# Altium schematic sheet Interface1.SchDoc
size A4
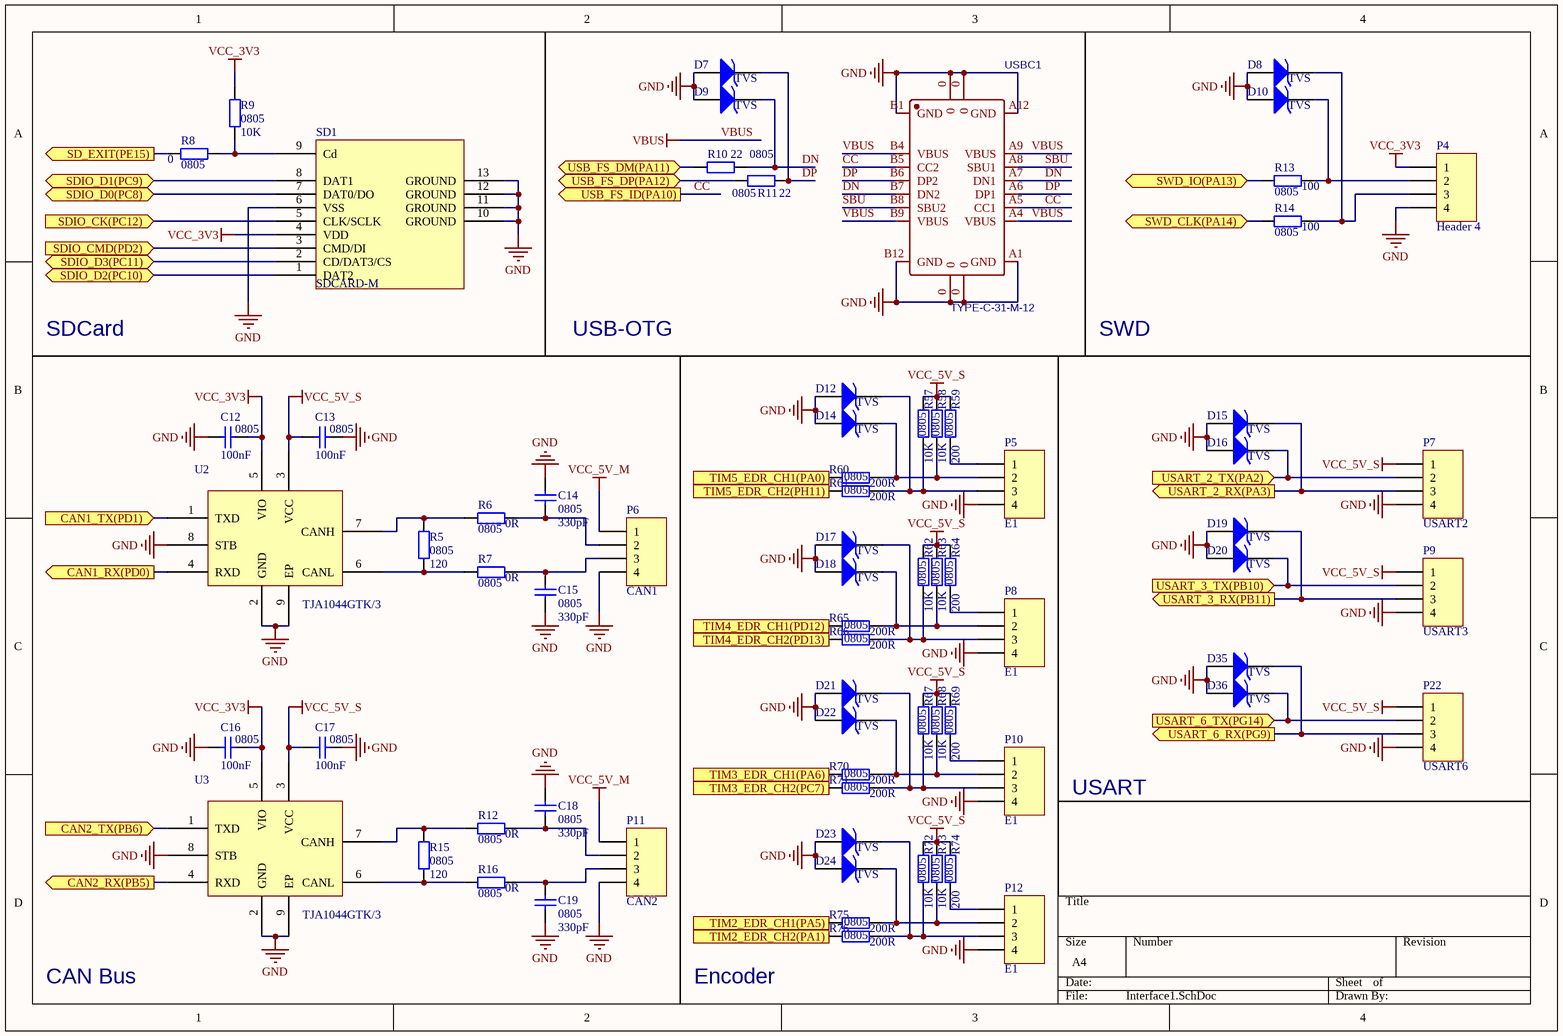
[diagram p0: Interface1.SchDoc]

## Parts
C12  0805  value 100nF  [C 0805_M]
C13  0805  value 100nF  [C 0805_M]
C14  0805  value 330pF  [C 0805_M]
C15  0805  value 330pF  [C 0805_M]
C16  0805  value 100nF  [C 0805_M]
C17  0805  value 100nF  [C 0805_M]
C18  0805  value 330pF  [C 0805_M]
C19  0805  value 330pF  [C 0805_M]
D7  TVS  [SOD-523]
D8  TVS  [SOD-523]
D9  TVS  [SOD-523]
D10  TVS  [SOD-523]
D12  TVS  [SOD-523]
D14  TVS  [SOD-523]
D15  TVS  [SOD-523]
D16  TVS  [SOD-523]
D17  TVS  [SOD-523]
D18  TVS  [SOD-523]
D19  TVS  [SOD-523]
D20  TVS  [SOD-523]
D21  TVS  [SOD-523]
D22  TVS  [SOD-523]
D23  TVS  [SOD-523]
D24  TVS  [SOD-523]
D35  TVS  [SOD-523]
D36  TVS  [SOD-523]
P4  Header 4  [HDR2.54-LI-4P]
P5  E1  [HDR2.54-LI-4P]
P6  CAN1  [HDR2.54-LI-4P]
P7  USART2  [HDR2.54-LI-4P]
P8  E1  [HDR2.54-LI-4P]
P9  USART3  [HDR2.54-LI-4P]
P10  E1  [HDR2.54-LI-4P]
P11  CAN2  [HDR2.54-LI-4P]
P12  E1  [HDR2.54-LI-4P]
P22  USART6  [HDR2.54-LI-4P]
R5  0805  value 120  [R 0805_L]
R6  0805  value 0R  [R 0805_L]
R7  0805  value 0R  [R 0805_L]
R8  0805  value 0  [R 0805_L]
R9  0805  value 10K  [R 0805_L]
R10  0805  value 22  [R 0805_L]
R11  0805  value 22  [R 0805_L]
R12  0805  value 0R  [R 0805_L]
R13  0805  value 100  [R 0805_L]
R14  0805  value 100  [R 0805_L]
R15  0805  value 120  [R 0805_L]
R16  0805  value 0R  [R 0805_L]
R57  0805  value 10K  [R 0805_L]
R58  0805  value 10K  [R 0805_L]
R59  0805  value 200  [R 0805_L]
R60  0805  value 200R  [R 0805_L]
R61  0805  value 200R  [R 0805_L]
R62  0805  value 10K  [R 0805_L]
R63  0805  value 10K  [R 0805_L]
R64  0805  value 200  [R 0805_L]
R65  0805  value 200R  [R 0805_L]
R66  0805  value 200R  [R 0805_L]
R67  0805  value 10K  [R 0805_L]
R68  0805  value 10K  [R 0805_L]
R69  0805  value 200  [R 0805_L]
R70  0805  value 200R  [R 0805_L]
R71  0805  value 200R  [R 0805_L]
R72  0805  value 10K  [R 0805_L]
R73  0805  value 10K  [R 0805_L]
R74  0805  value 200  [R 0805_L]
R75  0805  value 200R  [R 0805_L]
R76  0805  value 200R  [R 0805_L]
SD1  SDCARD-M  [SDCARD-M]
U2  TJA1044GTK/3  [HVSON8]
U3  TJA1044GTK/3  [HVSON8]
USBC1  TYPE-C-31-M-12  [TYPE-C-USB-17]

## Ports
CAN1_RX(PD0) (out), CAN1_TX(PD1) (in), CAN2_RX(PB5) (out), CAN2_TX(PB6) (in), SD_EXIT(PE15) (out), SDIO_CK(PC12) (in), SDIO_CMD(PD2) (in), SDIO_D0(PC8) (bidir), SDIO_D1(PC9) (bidir), SDIO_D2(PC10) (bidir), SDIO_D3(PC11) (bidir), SWD_CLK(PA14) (bidir), SWD_IO(PA13) (bidir), TIM2_EDR_CH1(PA5) (out), TIM2_EDR_CH2(PA1) (out), TIM3_EDR_CH1(PA6) (out), TIM3_EDR_CH2(PC7) (out), TIM4_EDR_CH1(PD12) (out), TIM4_EDR_CH2(PD13) (out), TIM5_EDR_CH1(PA0) (out), TIM5_EDR_CH2(PH11) (out), USART_2_RX(PA3) (out), USART_2_TX(PA2) (in), USART_3_RX(PB11) (out), USART_3_TX(PB10) (in), USART_6_RX(PG9) (out), USART_6_TX(PG14) (in), USB_FS_DM(PA11) (bidir), USB_FS_DP(PA12) (bidir), USB_FS_ID(PA10) (out)

## Nets
GND: C12.1 C13.2 C14.2 C15.1 C16.1 C17.2 C18.2 C19.1 D7.1(A) D8.1(A) D9.1(A) D10.1(A) D12.1(A) D14.1(A) D15.1(A) D16.1(A) D17.1(A) D18.1(A) D19.1(A) D20.1(A) D21.1(A) D22.1(A) D23.1(A) D24.1(A) D35.1(A) D36.1(A) P4.4 P5.4 P6.4 P7.4 P8.4 P9.4 P10.4 P11.4 P12.4 P22.4 SD1.6(VSS) SD1.10(GROUND) SD1.11(GROUND) SD1.12(GROUND) SD1.13(GROUND) U2.2(GND) U2.8(STB) U2.9(EP) U3.2(GND) U3.8(STB) U3.9(EP) USBC1.0 USBC1.A1(GND) USBC1.A12(GND) USBC1.B1(GND) USBC1.B12(GND)
VBUS: USBC1.A4(VBUS) USBC1.A9(VBUS) USBC1.B4(VBUS) USBC1.B9(VBUS)
VCC_3V3: C12.2 C16.2 P4.1 R9.2 SD1.4(VDD) U2.5(VIO) U3.5(VIO)
VCC_5V_M: P6.1 P11.1
VCC_5V_S: C13.1 C17.1 P7.1 P9.1 P22.1 R57.2 R58.2 R59.2 R62.2 R63.2 R64.2 R67.2 R68.2 R69.2 R72.2 R73.2 R74.2 U2.3(VCC) U3.3(VCC)
CAN1_RX(PD0): U2.4(RXD) ; port CAN1_RX(PD0)
CAN1_TX(PD1): U2.1(TXD) ; port CAN1_TX(PD1)
CAN2_RX(PB5): U3.4(RXD) ; port CAN2_RX(PB5)
CAN2_TX(PB6): U3.1(TXD) ; port CAN2_TX(PB6)
CC: USBC1.A5(CC1) USBC1.B5(CC2) ; port USB_FS_ID(PA10)
DN: D9.2(K) R10.2 USBC1.A7(DN1) USBC1.B7(DN2)
DP: D7.2(K) R11.2 USBC1.A6(DP1) USBC1.B6(DP2)
SBU: USBC1.A8(SBU1) USBC1.B8(SBU2)
SD_EXIT(PE15): R8.1 ; port SD_EXIT(PE15)
SDIO_CK(PC12): SD1.5(CLK/SCLK) ; port SDIO_CK(PC12)
SDIO_CMD(PD2): SD1.3(CMD/DI) ; port SDIO_CMD(PD2)
SDIO_D0(PC8): SD1.7(DAT0/DO) ; port SDIO_D0(PC8)
SDIO_D1(PC9): SD1.8(DAT1) ; port SDIO_D1(PC9)
SDIO_D2(PC10): SD1.1(DAT2) ; port SDIO_D2(PC10)
SDIO_D3(PC11): SD1.2(CD/DAT3/CS) ; port SDIO_D3(PC11)
SWD_CLK(PA14): R14.1 ; port SWD_CLK(PA14)
SWD_IO(PA13): R13.1 ; port SWD_IO(PA13)
TIM2_EDR_CH1(PA5): R75.1 ; port TIM2_EDR_CH1(PA5)
TIM2_EDR_CH2(PA1): R76.1 ; port TIM2_EDR_CH2(PA1)
TIM3_EDR_CH1(PA6): R70.1 ; port TIM3_EDR_CH1(PA6)
TIM3_EDR_CH2(PC7): R71.1 ; port TIM3_EDR_CH2(PC7)
TIM4_EDR_CH1(PD12): R65.1 ; port TIM4_EDR_CH1(PD12)
TIM4_EDR_CH2(PD13): R66.1 ; port TIM4_EDR_CH2(PD13)
TIM5_EDR_CH1(PA0): R60.1 ; port TIM5_EDR_CH1(PA0)
TIM5_EDR_CH2(PH11): R61.1 ; port TIM5_EDR_CH2(PH11)
USART_2_RX(PA3): D15.2(K) P7.3 ; port USART_2_RX(PA3)
USART_2_TX(PA2): D16.2(K) P7.2 ; port USART_2_TX(PA2)
USART_3_RX(PB11): D19.2(K) P9.3 ; port USART_3_RX(PB11)
USART_3_TX(PB10): D20.2(K) P9.2 ; port USART_3_TX(PB10)
USART_6_RX(PG9): D35.2(K) P22.3 ; port USART_6_RX(PG9)
USART_6_TX(PG14): D36.2(K) P22.2 ; port USART_6_TX(PG14)
USB_FS_DM(PA11): R10.1 ; port USB_FS_DM(PA11)
USB_FS_DP(PA12): R11.1 ; port USB_FS_DP(PA12)
NetC14_1: C14.1 P6.2 R6.1
NetC15_2: C15.2 P6.3 R7.1
NetC18_1: C18.1 P11.2 R12.1
NetC19_2: C19.2 P11.3 R16.1
NetD8_2: D8.2(K) P4.3 R14.2
NetD10_2: D10.2(K) P4.2 R13.2
NetD12_2: D12.2(K) P5.3 R57.1 R61.2
NetD14_2: D14.2(K) P5.2 R58.1 R60.2
NetD17_2: D17.2(K) P8.3 R62.1 R66.2
NetD18_2: D18.2(K) P8.2 R63.1 R65.2
NetD21_2: D21.2(K) P10.3 R67.1 R71.2
NetD22_2: D22.2(K) P10.2 R68.1 R70.2
NetD23_2: D23.2(K) P12.3 R72.1 R76.2
NetD24_2: D24.2(K) P12.2 R73.1 R75.2
NetP5_1: P5.1 R59.1
NetP8_1: P8.1 R64.1
NetP10_1: P10.1 R69.1
NetP12_1: P12.1 R74.1
NetR5_1: R5.1 R7.2 U2.6(CANL)
NetR5_2: R5.2 R6.2 U2.7(CANH)
NetR8_2: R8.2 R9.1 SD1.9(Cd)
NetR12_2: R12.2 R15.2 U3.7(CANH)
NetR15_1: R15.1 R16.2 U3.6(CANL)

## Notes on the sheet
- SDCard
- USB-OTG
- SWD
- USART
- CAN Bus
- Encoder

## Library data of the parts
C12-C19 = CAP
D7-D10 D12 D14-D24 D35 D36 = D: High Conductance Fast Diode; Published: 8-Jun-2000; LatestRevisionDate: 17-Jul-2002; LatestRevisionNote: Re-released for DXP Platform.; DatasheetVersion: 1997; PackageReference: DO-35; Publisher: Altium Limited; PackageDescription: Diode, Axial; Body 3.8 x 1.9 mm (LxDia. max), Lead Dia. 0.53 mm (max); Code_JEDEC: DO-204-AH; ComponentLink1Description: Manufacturer Link; ComponentLink1URL: http://www.fairchildsemi.com/; ComponentLink2Description: Datasheet; ComponentLink2URL: http://www.fairchildsemi.com/ds/1N%2F1N4148.pdf
P4-P12 P22 = Header 4: Header, 4-Pin; LatestRevisionDate: 17-Jul-2002; LatestRevisionNote: Re-released for DXP Platform.; Publisher: Altium Limited
R5-R16 R57-R76 = RES2: Resistor; Published: 8-Jun-2000; LatestRevisionDate: 17-Jul-2002; LatestRevisionNote: Re-released for DXP Platform.; PackageReference: AXIAL-0.3; Publisher: Altium Limited; PackageDescription: Axial Device, Thru-Hole; 2 Leads; 0.3 in Pin Spacing
SD1 = SDCARD-M: TF卡槽